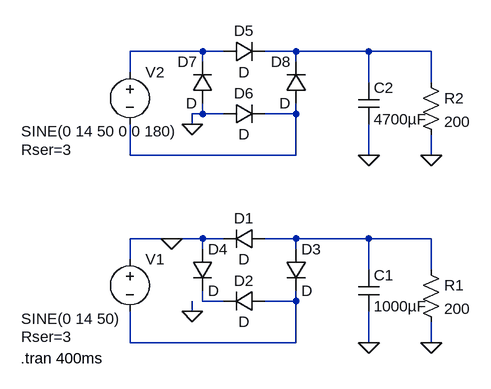
[diagram p0: schematic negative_transformer.asc]
negative_transformer.asc, the LTspice schematic file:
Version 4
SHEET 1 880 680
WIRE 32 -160 -80 -160
WIRE 64 -160 32 -160
WIRE 176 -160 128 -160
WIRE 288 -160 176 -160
WIRE 384 -160 288 -160
WIRE 32 -144 32 -160
WIRE 176 -144 176 -160
WIRE -80 -128 -80 -160
WIRE 288 -112 288 -160
WIRE 384 -112 384 -160
WIRE 32 -64 32 -80
WIRE 32 -64 16 -64
WIRE 64 -64 32 -64
WIRE 176 -64 176 -80
WIRE 176 -64 128 -64
WIRE 16 -48 16 -64
WIRE -80 0 -80 -48
WIRE 176 0 176 -64
WIRE 176 0 -80 0
WIRE 288 0 288 -48
WIRE 384 0 384 -32
WIRE -16 128 -80 128
WIRE 32 128 -16 128
WIRE 64 128 32 128
WIRE 176 128 128 128
WIRE 288 128 176 128
WIRE 384 128 288 128
WIRE 32 144 32 128
WIRE 176 144 176 128
WIRE -80 160 -80 128
WIRE 288 176 288 128
WIRE 384 176 384 128
WIRE 32 224 32 208
WIRE 64 224 32 224
WIRE 176 224 176 208
WIRE 176 224 128 224
WIRE 16 240 16 224
WIRE -80 288 -80 240
WIRE 176 288 176 224
WIRE 176 288 -80 288
WIRE 288 288 288 240
WIRE 384 288 384 256
FLAG 16 240 0
FLAG 288 288 0
FLAG 384 288 0
FLAG 16 -48 0
FLAG 288 0 0
FLAG 384 0 0
FLAG -16 128 0
SYMBOL diode 128 112 R90
WINDOW 0 0 32 VBottom 2
WINDOW 3 32 32 VTop 2
SYMATTR InstName D1
SYMBOL diode 128 208 R90
WINDOW 0 0 32 VBottom 2
WINDOW 3 32 32 VTop 2
SYMATTR InstName D2
SYMBOL diode 160 144 R0
SYMATTR InstName D3
SYMBOL diode 16 144 R0
SYMATTR InstName D4
SYMBOL voltage -80 144 R0
WINDOW 3 -167 107 Left 2
WINDOW 123 0 0 Left 2
WINDOW 39 -167 135 Left 2
SYMATTR Value SINE(0 14 50)
SYMATTR SpiceLine Rser=3
SYMATTR InstName V1
SYMBOL cap 272 176 R0
SYMATTR InstName C1
SYMATTR Value 1000µF
SYMATTR SpiceLine Rser=0.1
SYMBOL res 368 160 R0
SYMATTR InstName R1
SYMATTR Value 200
SYMBOL voltage -80 -144 R0
WINDOW 3 -167 107 Left 2
WINDOW 123 0 0 Left 2
WINDOW 39 -167 135 Left 2
SYMATTR Value SINE(0 14 50 0 0 180)
SYMATTR SpiceLine Rser=3
SYMATTR InstName V2
SYMBOL cap 272 -112 R0
SYMATTR InstName C2
SYMATTR Value 4700µF
SYMATTR SpiceLine Rser=0.1
SYMBOL res 368 -128 R0
SYMATTR InstName R2
SYMATTR Value 200
SYMBOL diode 64 -144 R270
WINDOW 0 32 32 VTop 2
WINDOW 3 0 32 VBottom 2
SYMATTR InstName D5
SYMBOL diode 64 -48 R270
WINDOW 0 32 32 VTop 2
WINDOW 3 0 32 VBottom 2
SYMATTR InstName D6
SYMBOL diode 48 -80 R180
WINDOW 0 24 64 Left 2
WINDOW 3 24 0 Left 2
SYMATTR InstName D7
SYMBOL diode 192 -80 R180
WINDOW 0 24 64 Left 2
WINDOW 3 24 0 Left 2
SYMATTR InstName D8
TEXT -248 312 Left 2 !.tran 400ms

The netlist it stands for:
* negative_transformer.asc
D1 N004 0 D
D2 N006 N005 D
D3 N004 N006 D
D4 0 N005 D
V1 0 N006 SINE(0 14 50) Rser=3
C1 N004 0 1000µF Rser=0.1
R1 N004 0 200
V2 N001 N003 SINE(0 14 50 0 0 180) Rser=3
C2 N002 0 4700µF Rser=0.1
R2 N002 0 200
D5 N001 N002 D
D6 0 N003 D
D7 0 N001 D
D8 N003 N002 D
.model D D
.lib standard.dio
.tran 400ms
.backanno
.end